# EAGLE design BALPGA (EAGLE 7.2.0)
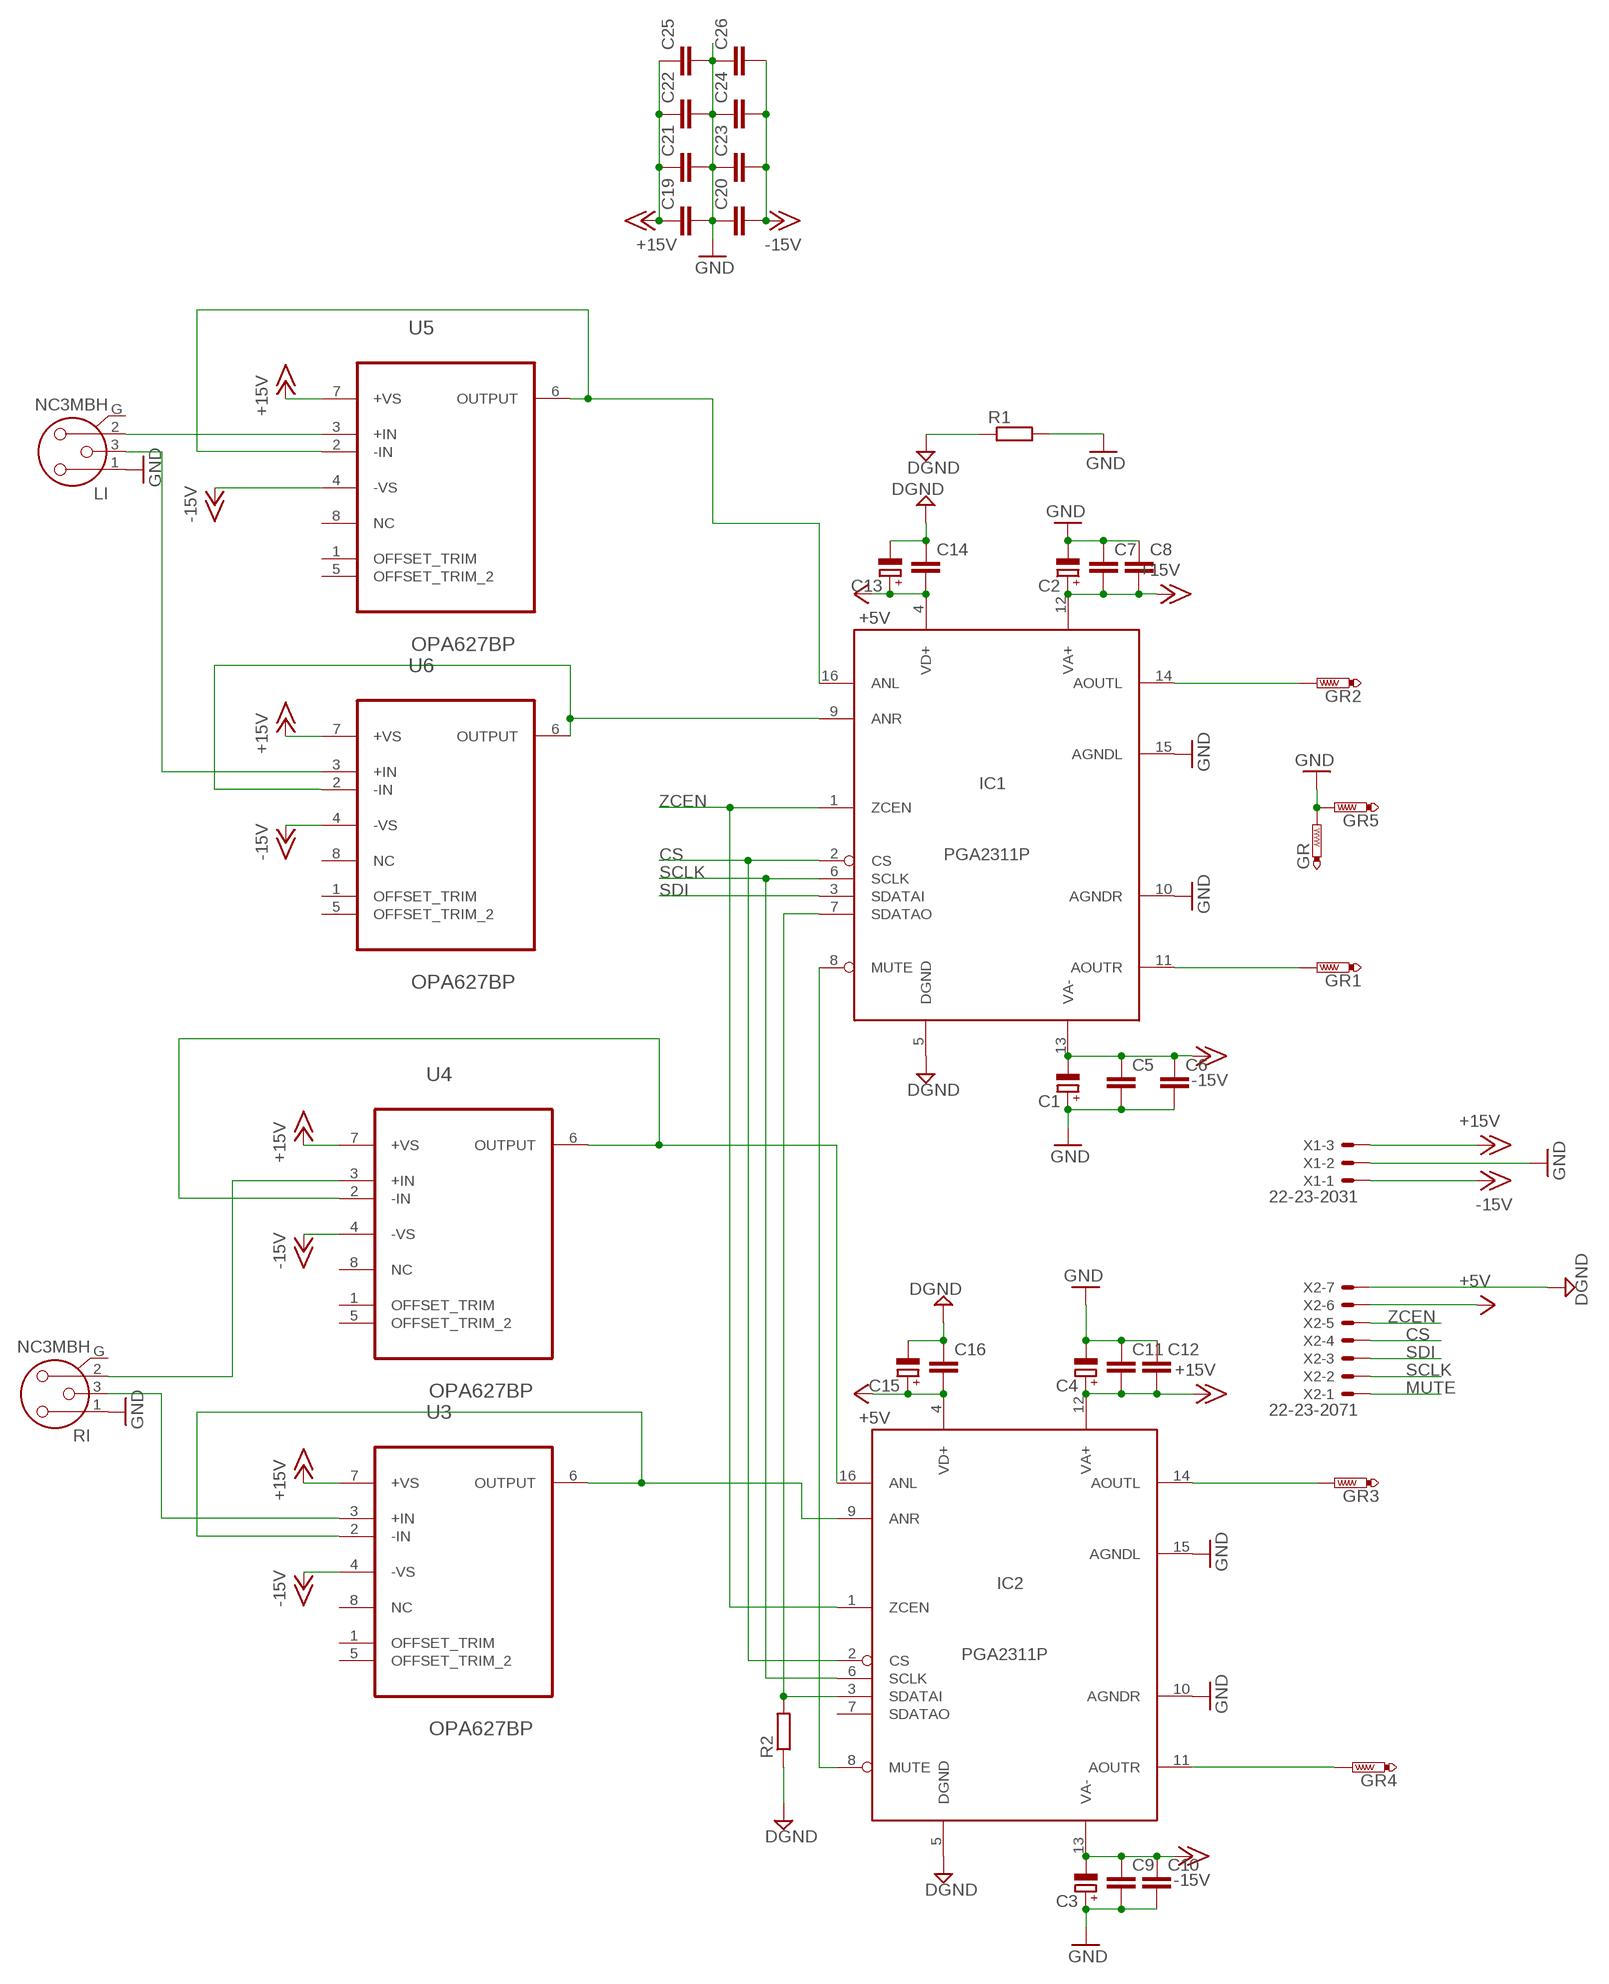
[diagram p0: schematic, sheet 1]

## Parts
C1  CPOL-EUSMCD  [SMC_D]
C2  CPOL-EUSMCD  [SMC_D]
C3  CPOL-EUSMCD  [SMC_D]
C4  CPOL-EUSMCD  [SMC_D]
C5  C-EUC1206  [C1206]
C6  C-EUC1206  [C1206]
C7  C-EUC1206  [C1206]
C8  C-EUC1206  [C1206]
C9  C-EUC1206  [C1206]
C10  C-EUC1206  [C1206]
C11  C-EUC1206  [C1206]
C12  C-EUC1206  [C1206]
C13  CPOL-EUSMCD  [SMC_D]
C14  C-EUC1206  [C1206]
C15  CPOL-EUSMCD  [SMC_D]
C16  C-EUC1206  [C1206]
C19  C-EUC1206  [C1206]
C20  C-EUC1206  [C1206]
C21  C-EUC1206  [C1206]
C22  C-EUC1206  [C1206]
C23  C-EUC1206  [C1206]
C24  C-EUC1206  [C1206]
C25  C-EUC1206  [C1206]
C26  C-EUC1206  [C1206]
GR  PTR1PAD1-17  [P1-17]
GR1  PTR1PAD1-17  [P1-17]
GR2  PTR1PAD1-17  [P1-17]
GR3  PTR1PAD1-17  [P1-17]
GR4  PTR1PAD1-17  [P1-17]
GR5  PTR1PAD1-17  [P1-17]
IC1  PGA2311P  [DIL16]
IC2  PGA2311P  [DIL16]
LI  NC3MBH  [NC3MBH]
R1  R-EU_0207/10  [0207/10]
R2  R-EU_R1206  [R1206]
RI  NC3MBH  [NC3MBH]
U3  OPA627BP  [DIL08]
U4  OPA627BP  [DIL08]
U5  OPA627BP  [DIL08]
U6  OPA627BP  [DIL08]
X1  22-23-2031  [22-23-2031]
X2  22-23-2071  [22-23-2071]

## Nets
+5V: C13.+ C14.2 C15.+ C16.2 IC1.4(VD+) IC2.4(VD+) X2.6
+15V: C2.+ C4.+ C7.2 C8.2 C11.2 C12.2 C19.1 C21.1 C22.1 C25.1 IC1.12(VA+) IC2.12(VA+) U3.7(+VS) U4.7(+VS) U5.7(+VS) U6.7(+VS) X1.3
-15V: C1.- C3.- C5.1 C6.1 C9.1 C10.1 C20.2 C23.2 C24.2 C26.2 IC1.13(VA-) IC2.13(VA-) U3.4(-VS) U4.4(-VS) U5.4(-VS) U6.4(-VS) X1.1
CS: IC1.2(CS) IC2.2(CS) X2.4
DGND: C13.- C14.1 C15.- C16.1 IC1.5(DGND) IC2.5(DGND) R1.1 R2.1 X2.7
GND: C1.+ C2.- C3.+ C4.- C5.2 C6.2 C7.1 C8.1 C9.2 C10.2 C11.1 C12.1 C19.2 C20.1 C21.2 C22.2 C23.1 C24.1 C25.2 C26.1 GR5.TP GR.TP IC1.10(AGNDR) IC1.15(AGNDL) IC2.10(AGNDR) IC2.15(AGNDL) LI.1 R1.2 RI.1 X1.2
MUTE: IC1.8(MUTE) IC2.8(MUTE) X2.1
N$1: LI.2 U5.3(+IN)
N$2: LI.3 U6.3(+IN)
N$3: RI.3 U3.3(+IN)
N$4: IC2.9(ANR) U3.2(-IN) U3.6(OUTPUT)
N$5: RI.2 U4.3(+IN)
N$8: IC1.16(ANL) U5.2(-IN) U5.6(OUTPUT)
N$9: IC1.7(SDATAO) IC2.3(SDATAI) R2.2
N$10: IC1.9(ANR) U6.2(-IN) U6.6(OUTPUT)
N$11: GR1.TP IC1.11(AOUTR)
N$12: GR2.TP IC1.14(AOUTL)
N$18: IC2.16(ANL) U4.2(-IN) U4.6(OUTPUT)
N$19: GR3.TP IC2.14(AOUTL)
N$27: GR4.TP IC2.11(AOUTR)
SCLK: IC1.6(SCLK) IC2.6(SCLK) X2.2
SDI: IC1.3(SDATAI) X2.3
ZCEN: IC1.1(ZCEN) IC2.1(ZCEN) X2.5
Unconnected: IC2.7(SDATAO) LI.G RI.G U3.1(OFFSET_TRIM) U3.5(OFFSET_TRIM_2) U3.8(NC) U4.1(OFFSET_TRIM) U4.5(OFFSET_TRIM_2) U4.8(NC) U5.1(OFFSET_TRIM) U5.5(OFFSET_TRIM_2) U5.8(NC) U6.1(OFFSET_TRIM) U6.5(OFFSET_TRIM_2) U6.8(NC)

## Library data of the parts
C1-C4 C13 C15 = resistor:CPOL-EU: POLARIZED CAPACITOR, European symbol
C5-C12 C14 C16 C19-C26 = resistor:C-EU: CAPACITOR, European symbol
GR GR1-GR5 = testpad:PTR1: TEST PIN
IC1 IC2 = Vwvwbg:PGA2311
LI RI = con-neutrik_ag:NC3: Neutrik Audio Connector XLR SERIES Stereo 1/4" jack Source: www.neutrik.com/; MF: NEUTRIK; MPN: NC3MBH; OC_FARNELL: unknown; OC_NEWARK: 91F3470
R1 = resistor:R-EU_: RESISTOR, European symbol
R2 = Vwvwbg:R-EU_: RESISTOR, European symbol
U3-U6 = Vwvwbg:OPA627BP: OPERATIONAL AMPLIFIER
X1 = con-molex:22-23-2031: .100" (2.54mm) Center Header - 3 Pin; MF: MOLEX; MPN: 22-23-2031; OC_FARNELL: 1462950; OC_NEWARK: 30C0862
X2 = con-molex:22-23-2071: .100" (2.54mm) Center Header - 7 Pin; MF: MOLEX; MPN: 22-23-2071; OC_FARNELL: 1654534; OC_NEWARK: 56H0445

## Board
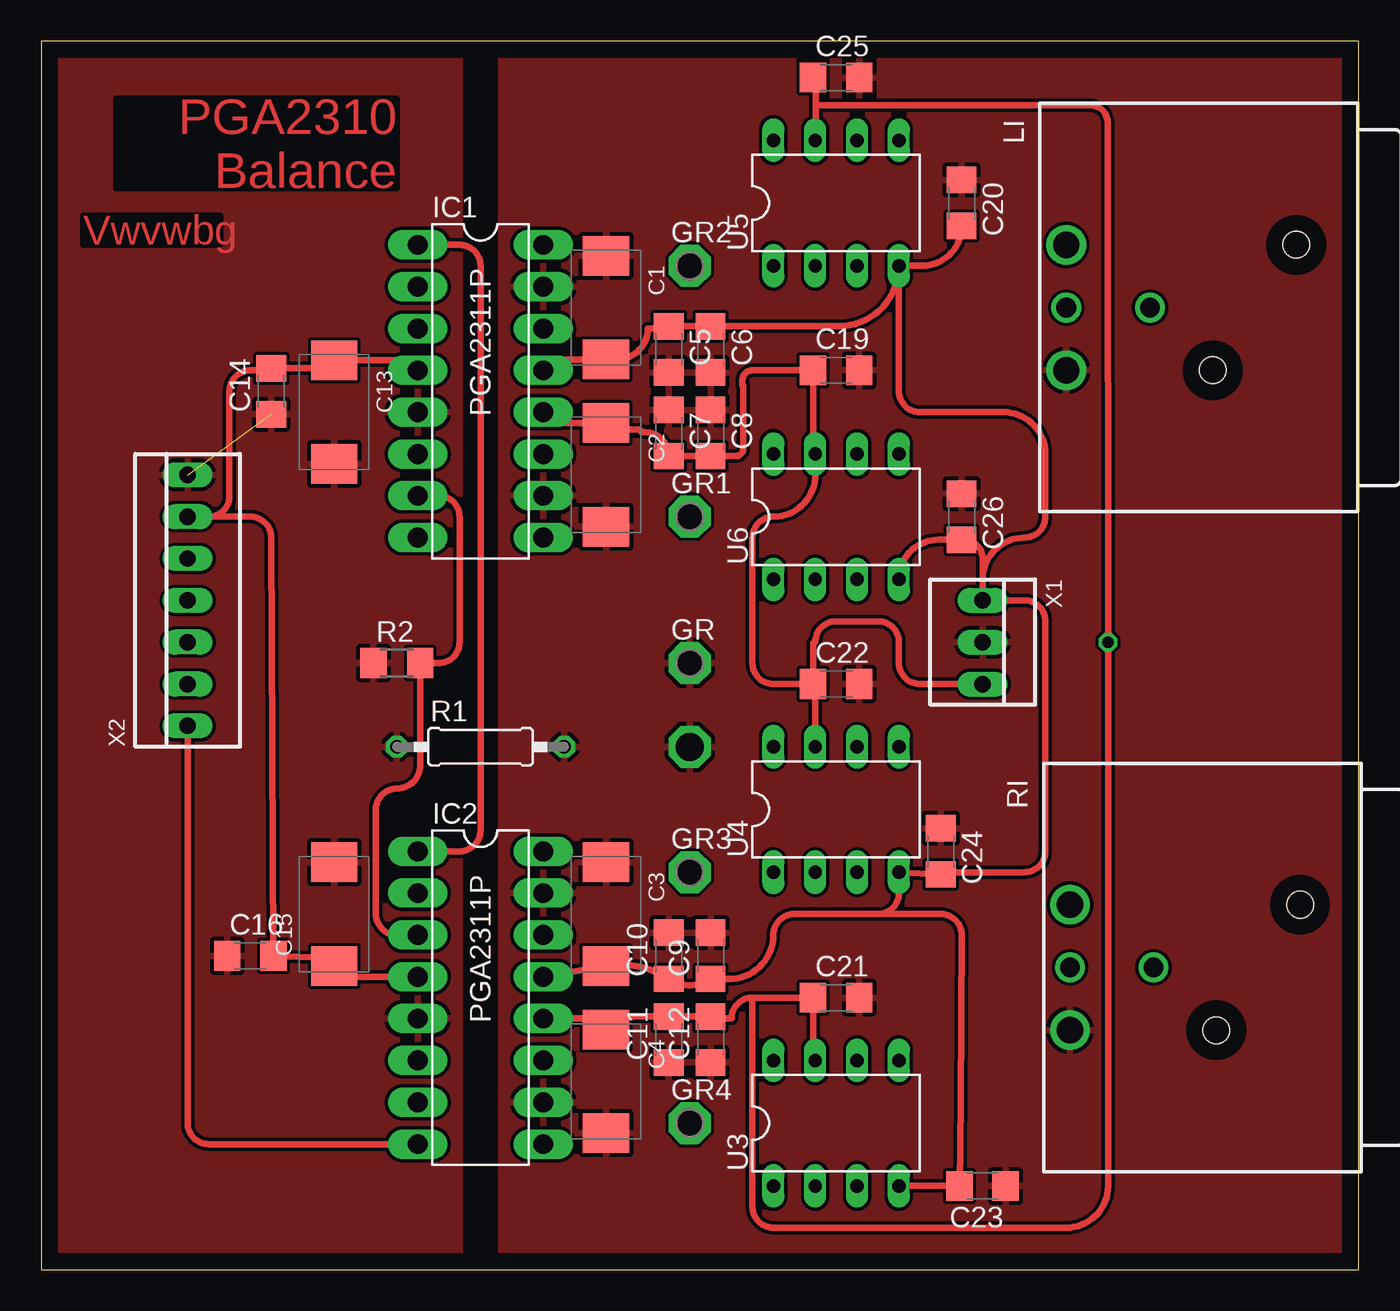
[diagram p1: board, top side]
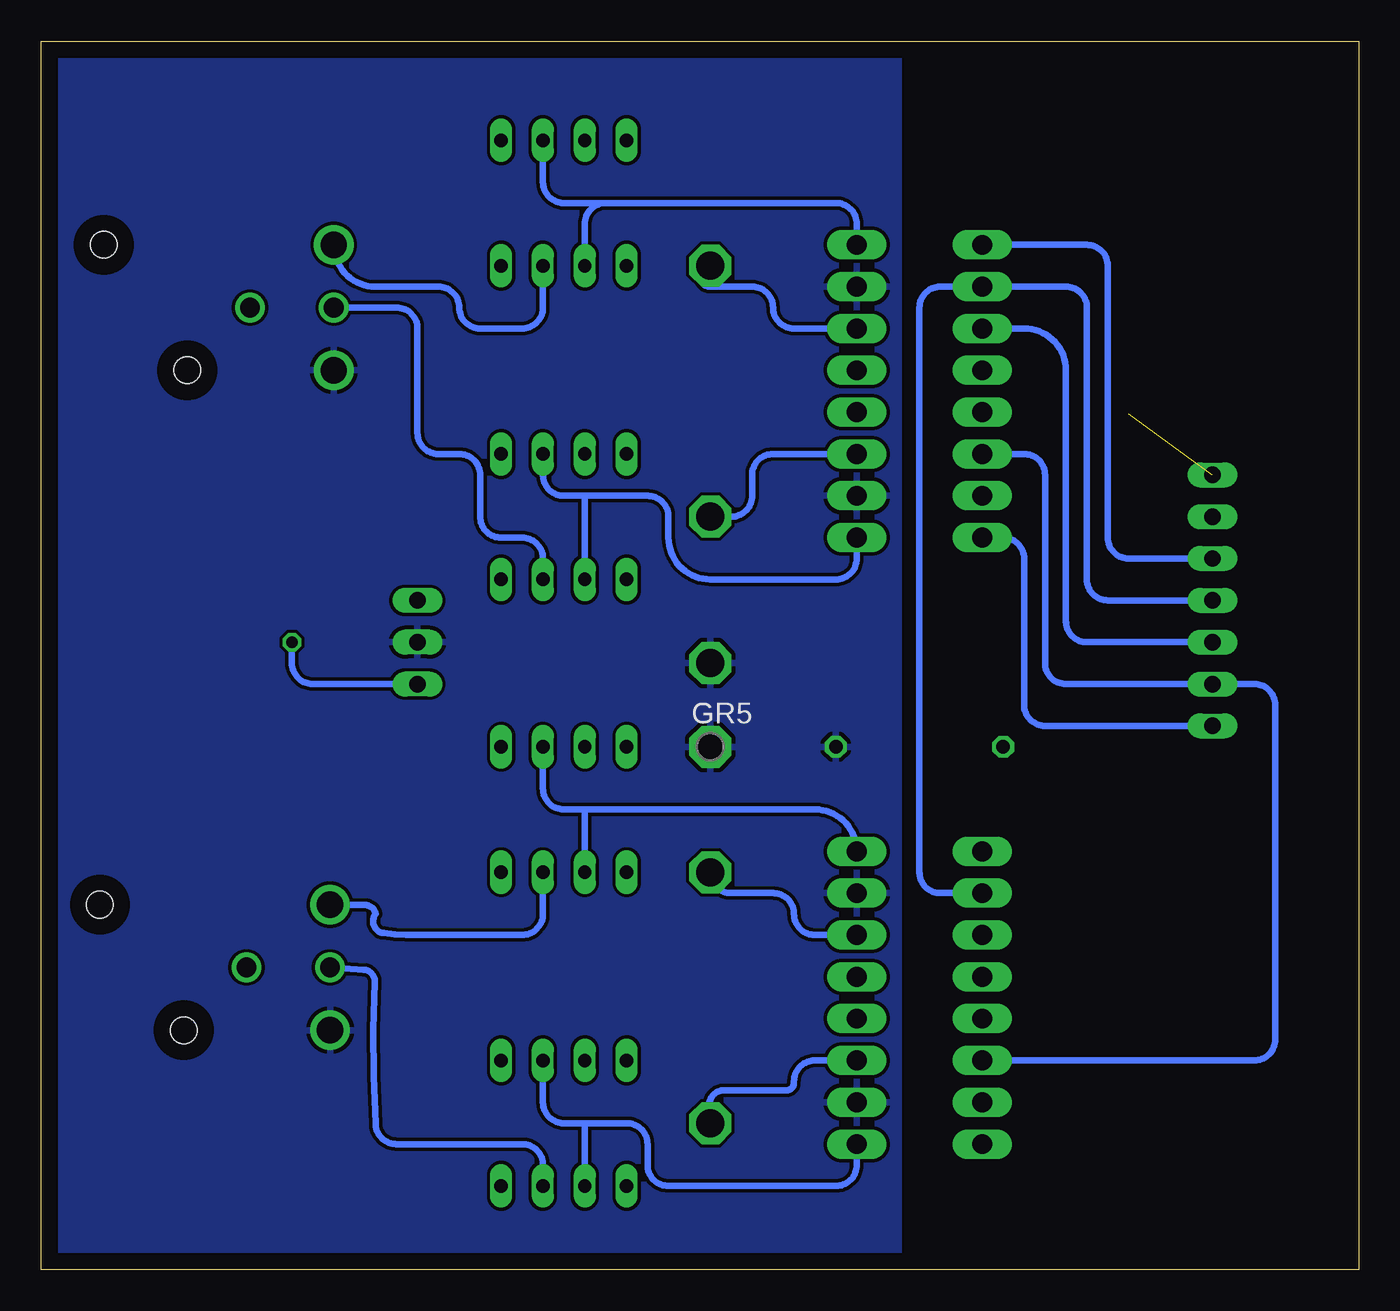
[diagram p2: board, bottom side, seen from below]

Size 79.99 x 74.6 mm. Coordinates in mm from the lower left corner, seen from the top.
Outline: 0,0 79.99,0 79.99,74.6 0,74.6 0,0
Copper layers (1*16): Top 0.035mm / dielectric 1.5mm / Bottom 0.035mm
Design rules "default": minimum track width 10mil, minimum drill 24mil, track to track 8mil, track to pad 8mil, pad to pad 8mil, via to via 8mil, smd to smd 8mil, copper to edge 40mil, drill to drill 8mil, minimum pad ring 10mil, minimum via ring 8mil, stop-mask expansion 4mil, vias tented up to drill 0mil, thermal gap 10mil

### Footprints (pad centres in the part's own frame; a part is rotated, then mirrored left to right if it is on the bottom)
SMC_D = smd 2.4 x 2.8: + -3.15,0; - 3.15,0
C1206 = smd 1.6 x 1.8: 1 -1.4,0; 2 1.4,0
P1-17 = drill 1.702 pad 2.54 octagon: TP 0,0
DIL16 = drill 1.2 long: 1 -8.89,-3.81; 2 -6.35,-3.81; 3 -3.81,-3.81; 4 -1.27,-3.81; 5 1.27,-3.81; 6 3.81,-3.81; 7 6.35,-3.81; 8 8.89,-3.81; 9 8.89,3.81; 10 6.35,3.81; 11 3.81,3.81; 12 1.27,3.81; 13 -1.27,3.81; 14 -3.81,3.81; 15 -6.35,3.81; 16 -8.89,3.81
NC3MBH = drill 1.6: 1 3.81,0; 2 -3.81,0 | drill 1.2: 3 0,0; G 0,5.08 | hole 1.6: -3.81,13.97; 3.81,8.89
0207/10 = drill 0.813 octagon: 1 -5.08,0; 2 5.08,0
R1206 = smd 1.6 x 1.803: 1 -1.422,0; 2 1.422,0
DIL08 = drill 0.813 long: 1 -3.81,-3.81; 2 -1.27,-3.81; 3 1.27,-3.81; 4 3.81,-3.81; 5 3.81,3.81; 6 1.27,3.81; 7 -1.27,3.81; 8 -3.81,3.81
22-23-2031 = drill 1 long: 1 -2.54,0; 2 0,0; 3 2.54,0
22-23-2071 = drill 1 long: 1 -7.62,0; 2 -5.08,0; 3 -2.54,0; 4 0,0; 5 2.54,0; 6 5.08,0; 7 7.62,0

### Placement (x,y rotation side)
C1  34.29,58.42 270 top
C2  34.29,48.26 270 top
C3  34.29,21.59 270 top
C4  34.29,11.43 270 top
C5  38.1,55.88 270 top
C6  40.64,55.88 270 top
C7  38.1,50.8 270 top
C8  40.64,50.8 270 top
C9  40.64,19.05 90 top
C10  38.1,19.05 90 top
C11  38.1,13.97 90 top
C12  40.64,13.97 90 top
C13  17.78,52.07 270 top
C14  13.97,53.34 90 top
C15  17.78,21.59 90 top
C16  12.7,19.05 0 top
C19  48.26,54.61 0 top
C20  55.88,64.77 270 top
C21  48.26,16.51 0 top
C22  48.26,35.56 0 top
C23  57.15,5.08 180 top
C24  54.61,25.4 270 top
C25  48.26,72.39 0 top
C26  55.88,45.72 270 top
GR  39.37,36.83 0 top
GR1  39.37,45.72 0 top
GR2  39.37,60.96 0 top
GR3  39.37,24.13 0 top
GR4  39.37,8.89 0 top
GR5  39.37,31.75 0 bottom
IC1  26.67,53.34 270 top
IC2  26.67,16.51 270 top
LI  62.23,58.42 270 top
R1  26.67,31.75 0 top
R2  21.59,36.83 0 top
RI  62.45,18.35 270 top
U3  48.26,8.89 0 top
U4  48.26,27.94 0 top
U5  48.26,64.77 0 top
U6  48.26,45.72 0 top
X1  57.15,38.1 270 top
X2  8.89,40.64 90 top

### Tracks (layer width: path | path; a pad name or v marks a point on that pad's centre or on a via)
+5V
  Top 0.406: X2.6 10.16,45.72 | 10.16,45.72 arc90 11.43,46.99 11.43,53.34 arc-90 12.7,54.61 13.84,54.61 arc90 C14.2 17.3,54.74 arc90 C13.+ 22.25,55.22 arc-90 IC1.4 | IC2.4 17.78,17.78 C15.+ arc90 17.3,18.92 C16.2 13.97,44.45 arc90 12.7,45.72 10.16,45.72
+15V  (via drill 0.7)
  Top 0.406: X1.3 53.34,35.56 arc-90 52.07,36.83 52.07,38.1 arc90 50.8,39.37 48.26,39.37 arc90 46.99,38.1 arc90 46.86,37.97 C22.1 | C22.1 arc-90 46.99,35.43 U4.7 | U3.7 arc-90 46.86,12.83 C21.1 43.18,16.51 | IC2.12 33.02,15.24 arc90 33.68,14.58 C4.+ arc-90 35.08,15.37 C11.2 C12.2 | C12.2 40.64,15.24 | C19.1 46.86,49.66 arc90 U6.7 46.99,48.26 arc-90 44.45,45.72 arc90 43.18,44.45 43.18,36.83 arc90 44.45,35.56 C22.1 | C19.1 46.99,54.61 | C25.1 arc-90 46.99,72.26 47.02,70.7 | 43.18,16.51 arc90 41.91,15.24 40.77,15.24 arc-90 C12.2 | C19.1 43.18,54.61 arc90 42.57,54 42.57,53.7 arc-90 42.63,53.64 42.63,49.86 arc-90 42.17,49.4 C8.2 C7.2 arc90 36.65,50.85 36.42,50.85 arc90 36.27,51 34.74,51 arc90 34.33,51.41 C2.+ 31.14,51.41 arc-90 IC1.12 | U5.7 47.02,70.7 | 47.02,70.7 63.71,70.7 arc-90 64.74,69.67 v64.77,38.1 64.77,5.08 arc-90 62.23,2.54 44.45,2.54 arc-90 43.18,3.81 43.18,16.51
  Bottom 0.406: v64.77,38.1 64.77,36.83 arc-90 63.5,35.56 X1.3
-15V
  Top 0.406: IC1.13 arc-90 31.14,55.27 C1.- 34.95,55.27 arc90 36.83,57.15 37.97,57.15 arc90 C5.1 C6.1 48.39,57.28 arc90 U5.4 | U5.4 53.47,60.96 arc90 C20.2 | U6.4 arc-90 54.48,44.32 C26.2 56.01,44.32 arc-90 57.15,43.18 57.15,41.91 | 57.15,41.91 X1.1 59.69,40.64 arc-90 60.96,39.37 60.96,25.4 arc-90 59.69,24.13 54.74,24.13 arc90 C24.2 U4.4 52.07,22.86 arc-90 50.8,21.59 | 57.15,41.91 arc-90 59.69,44.45 arc90 60.96,45.72 60.96,49.53 arc90 58.42,52.07 53.34,52.07 arc-90 52.07,53.34 U5.4 | IC2.13 C3.- arc-43 C10.1 arc67 C9.1 41.78,17.65 arc90 44.45,20.32 arc-90 45.72,21.59 50.8,21.59 | U3.4 C23.2 | C23.2 55.88,5.08 | 50.8,21.59 54.61,21.59 arc-90 55.88,20.32 arc-1 C23.2
CS
  Bottom 0.406: X2.4 15.24,40.64 arc90 16.51,41.91 16.51,58.42 arc-90 17.78,59.69 IC1.2 25.4,59.69 arc-90 26.67,58.42 26.67,24.13 arc-90 25.4,22.86 IC2.2
DGND  (1 unrouted)
  pour Top: -1.27,78.74 25.4,80.01 25.4,-3.81 0,-1.27
GND
  pour Top: 27.94,78.74 27.94,-1.27 80.01,-1.27 80.01,78.74
  pour Bottom: 27.94,77.47 27.94,-3.81 90.17,-3.81 90.17,83.82 27.94,83.82
MUTE
  Top 0.406: IC2.8 10.16,7.62 arc-90 8.89,8.89 X2.1
  Bottom 0.406: X2.1 19.05,33.02 arc90 20.32,34.29 20.32,43.18 arc-90 21.59,44.45 IC1.8
N$1
  Bottom 0.406: LI.2 arc-90 59.69,59.69 55.88,59.69 arc90 54.61,58.42 arc-90 53.34,57.15 50.8,57.15 arc-90 49.53,58.42 U5.3
N$2
  Bottom 0.406: LI.3 58.42,58.42 arc90 57.15,57.15 57.15,50.8 arc-90 55.88,49.53 54.61,49.53 arc90 53.34,48.26 53.34,45.72 arc-90 52.07,44.45 50.8,44.45 arc90 49.53,43.18 U6.3
N$3
  Bottom 0.406: U3.3 49.53,6.35 arc-90 50.8,7.62 58.42,7.62 arc90 59.69,8.89 arc7 59.73,17.43 arc-89 60.42,18.21 RI.3
N$4
  Bottom 0.406: IC2.9 30.48,6.35 arc90 31.75,5.08 41.91,5.08 arc90 43.18,6.35 43.18,7.62 arc-90 44.45,8.89 46.99,8.89 | 46.99,8.89 48.26,8.89 arc90 49.53,10.16 U3.6 | U3.2 46.99,8.89
N$5
  Bottom 0.406: U4.3 49.53,21.59 arc90 50.8,20.32 57.15,20.32 arc6 59.19,20.43 arc121 59.69,21.59 arc-80 60.33,22.14 RI.2
N$8
  Bottom 0.406: IC1.16 30.48,63.5 arc-90 31.75,64.77 45.72,64.77 | 45.72,64.77 arc-90 46.99,63.5 U5.2 | U5.6 49.53,66.04 arc-90 48.26,64.77 45.72,64.77
N$9
  Top 0.406: IC1.7 24.13,46.99 arc-90 25.4,45.72 25.4,38.1 arc-90 24.13,36.83 R2.2 23.01,30.63 arc-90 21.59,29.21 arc90 20.32,27.94 20.32,21.59 arc90 21.59,20.32 IC2.3
N$10
  Bottom 0.406: IC1.9 30.48,43.18 arc90 31.75,41.91 39.37,41.91 arc90 41.91,44.45 41.91,45.72 arc-90 43.18,46.99 46.99,46.99 | 46.99,46.99 48.26,46.99 arc90 49.53,48.26 U6.6 | U6.2 46.99,46.99
N$11
  Bottom 0.406: IC1.11 35.56,49.53 arc-90 36.83,48.26 36.83,46.99 arc90 38.1,45.72 GR1.TP
N$12
  Bottom 0.406: IC1.14 34.29,57.15 arc90 35.56,58.42 arc-90 36.83,59.69 39.37,59.69 arc180 GR2.TP
N$18
  Bottom 0.406: IC2.16 arc-90 33.02,27.94 46.99,27.94 | 46.99,27.94 U4.2 | U4.6 49.53,29.21 arc-90 48.26,27.94 46.99,27.94
N$19
  Bottom 0.406: IC2.14 33.02,20.32 arc90 34.29,21.59 arc-90 35.56,22.86 38.1,22.86 arc90 GR3.TP
N$27
  Bottom 0.406: IC2.11 33.02,12.7 arc-90 34.29,11.43 34.29,11.34 arc90 34.74,10.89 38.52,10.89 arc-90 39.45,9.96 39.45,8.97 arc-90 GR4.TP
SCLK
  Bottom 0.406: IC1.6 20.32,49.53 arc90 19.05,48.26 19.05,36.83 arc-90 17.78,35.56 X2.2 6.35,35.56 arc90 5.08,34.29 5.08,13.97 arc90 6.35,12.7 IC2.6
SDI
  Bottom 0.406: X2.3 16.51,38.1 arc90 17.78,39.37 17.78,54.61 arc-90 20.32,57.15 IC1.3
ZCEN
  Top 0.406: IC2.1 25.4,25.4 arc90 26.67,26.67 26.67,60.96 arc90 25.4,62.23 IC1.1
  Bottom 0.406: X2.5 13.97,43.18 arc90 15.24,44.45 15.24,60.96 arc-90 16.51,62.23 IC1.1

### Text on the board
Top: PGA2310 / Balance | Vwvwbg